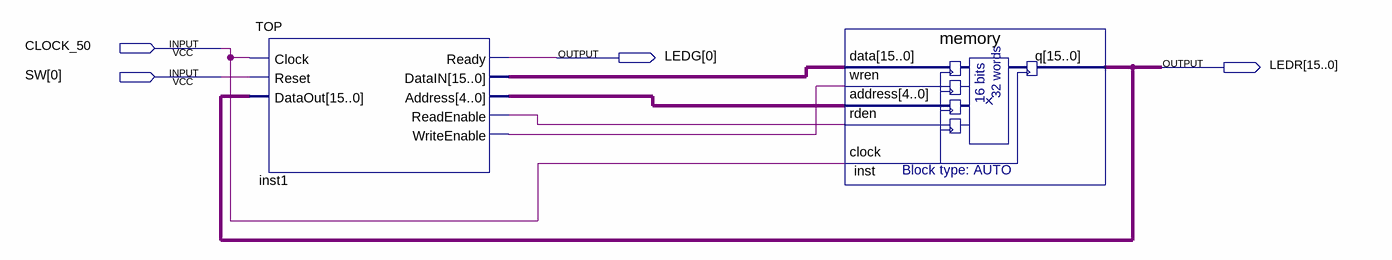
[diagram p0: schematic sheet]
// Quartus schematic MAIN.bdf as structural Verilog: 2 symbols, 4 pins
module MAIN (
  input  CLOCK_50,
  input  [0:0] SW,
  output [0:0] LEDG,
  output [15:0] LEDR
);

  wire inst1_readenable, inst1_writeenable;
  wire [4:0] inst1_address;
  wire [15:0] inst1_datain;

  TOP inst1 (
    .Clock(CLOCK_50), .Reset(SW[0]), .DataOut(LEDR), .Ready(LEDG[0]), .DataIN(inst1_datain),
    .Address(inst1_address), .ReadEnable(inst1_readenable), .WriteEnable(inst1_writeenable));
  memory inst (
    .data(inst1_datain), .wren(inst1_writeenable), .address(inst1_address), .rden(inst1_readenable),
    .clock(CLOCK_50), .q(LEDR));
endmodule
